# EAGLE design cubetto_1 (EAGLE 8.6.3)
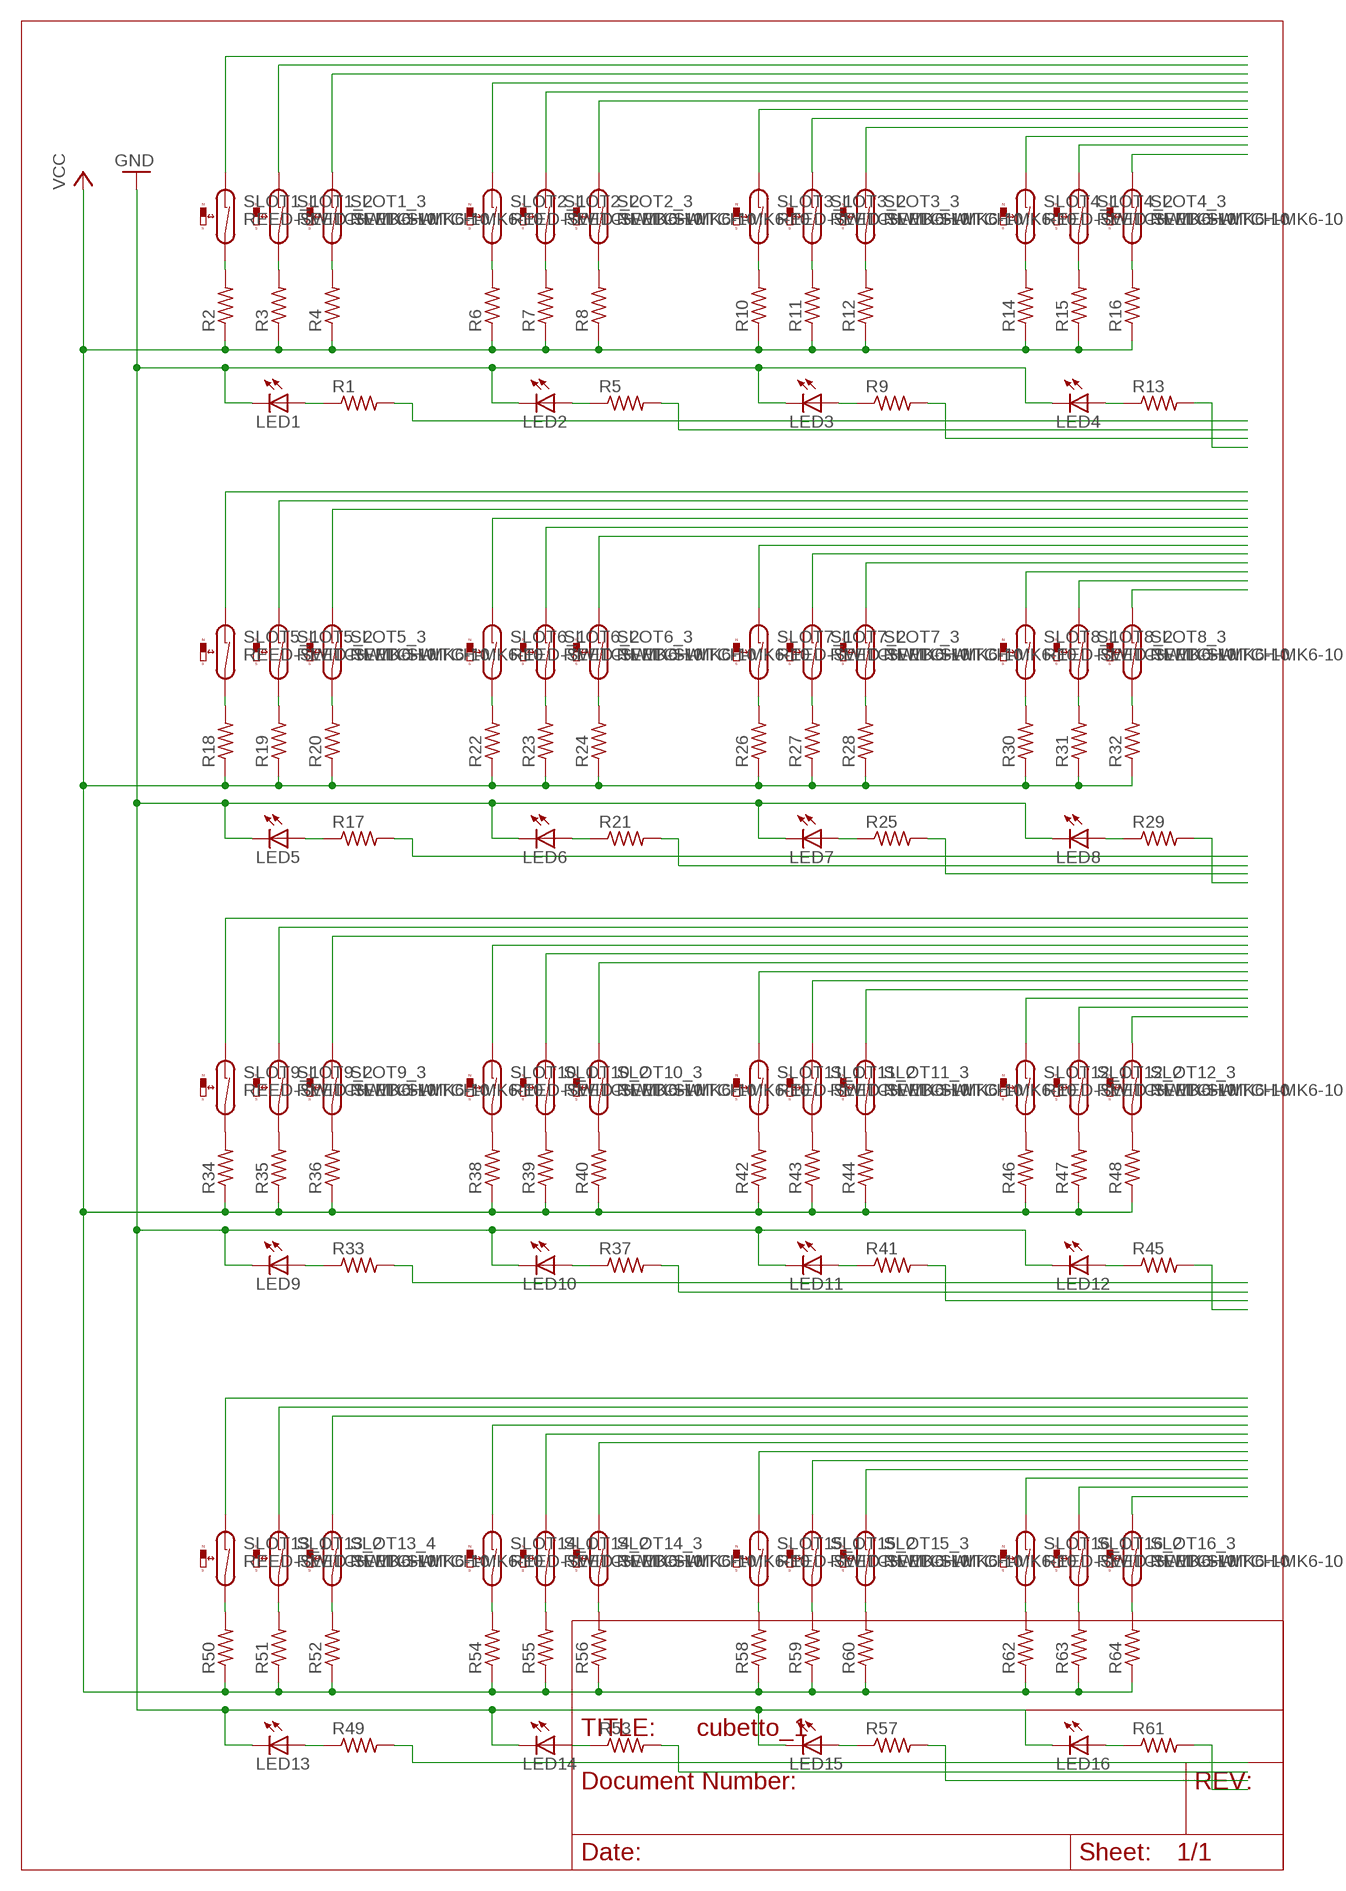
[diagram p0: schematic, sheet 1]

## Parts
LED1  LED3MM  [LED3MM]
LED2  LED3MM  [LED3MM]
LED3  LED3MM  [LED3MM]
LED4  LED3MM  [LED3MM]
LED5  LED3MM  [LED3MM]
LED6  LED3MM  [LED3MM]
LED7  LED3MM  [LED3MM]
LED8  LED3MM  [LED3MM]
LED9  LED3MM  [LED3MM]
LED10  LED3MM  [LED3MM]
LED11  LED3MM  [LED3MM]
LED12  LED3MM  [LED3MM]
LED13  LED3MM  [LED3MM]
LED14  LED3MM  [LED3MM]
LED15  LED3MM  [LED3MM]
LED16  LED3MM  [LED3MM]
R1  R-US_0207/10  [0207/10]
R2  R-US_0207/10  [0207/10]
R3  R-US_0207/10  [0207/10]
R4  R-US_0207/10  [0207/10]
R5  R-US_0207/10  [0207/10]
R6  R-US_0207/10  [0207/10]
R7  R-US_0207/10  [0207/10]
R8  R-US_0207/10  [0207/10]
R9  R-US_0207/10  [0207/10]
R10  R-US_0207/10  [0207/10]
R11  R-US_0207/10  [0207/10]
R12  R-US_0207/10  [0207/10]
R13  R-US_0207/10  [0207/10]
R14  R-US_0207/10  [0207/10]
R15  R-US_0207/10  [0207/10]
R16  R-US_0207/10  [0207/10]
R17  R-US_0207/10  [0207/10]
R18  R-US_0207/10  [0207/10]
R19  R-US_0207/10  [0207/10]
R20  R-US_0207/10  [0207/10]
R21  R-US_0207/10  [0207/10]
R22  R-US_0207/10  [0207/10]
R23  R-US_0207/10  [0207/10]
R24  R-US_0207/10  [0207/10]
R25  R-US_0207/10  [0207/10]
R26  R-US_0207/10  [0207/10]
R27  R-US_0207/10  [0207/10]
R28  R-US_0207/10  [0207/10]
R29  R-US_0207/10  [0207/10]
R30  R-US_0207/10  [0207/10]
R31  R-US_0207/10  [0207/10]
R32  R-US_0207/10  [0207/10]
R33  R-US_0207/10  [0207/10]
R34  R-US_0207/10  [0207/10]
R35  R-US_0207/10  [0207/10]
R36  R-US_0207/10  [0207/10]
R37  R-US_0207/10  [0207/10]
R38  R-US_0207/10  [0207/10]
R39  R-US_0207/10  [0207/10]
R40  R-US_0207/10  [0207/10]
R41  R-US_0207/10  [0207/10]
R42  R-US_0207/10  [0207/10]
R43  R-US_0207/10  [0207/10]
R44  R-US_0207/10  [0207/10]
R45  R-US_0207/10  [0207/10]
R46  R-US_0207/10  [0207/10]
R47  R-US_0207/10  [0207/10]
R48  R-US_0207/10  [0207/10]
R49  R-US_0207/10  [0207/10]
R50  R-US_0207/10  [0207/10]
R51  R-US_0207/10  [0207/10]
R52  R-US_0207/10  [0207/10]
R53  R-US_0207/10  [0207/10]
R54  R-US_0207/10  [0207/10]
R55  R-US_0207/10  [0207/10]
R56  R-US_0207/10  [0207/10]
R57  R-US_0207/10  [0207/10]
R58  R-US_0207/10  [0207/10]
R59  R-US_0207/10  [0207/10]
R60  R-US_0207/10  [0207/10]
R61  R-US_0207/10  [0207/10]
R62  R-US_0207/10  [0207/10]
R63  R-US_0207/10  [0207/10]
R64  R-US_0207/10  [0207/10]
SLOT1_1  REED-SWITCH-MK6-10  [MK6-10]
SLOT1_2  REED-SWITCH-MK6-10  [MK6-10]
SLOT1_3  REED-SWITCH-MK6-10  [MK6-10]
SLOT2_1  REED-SWITCH-MK6-10  [MK6-10]
SLOT2_2  REED-SWITCH-MK6-10  [MK6-10]
SLOT2_3  REED-SWITCH-MK6-10  [MK6-10]
SLOT3_1  REED-SWITCH-MK6-10  [MK6-10]
SLOT3_2  REED-SWITCH-MK6-10  [MK6-10]
SLOT3_3  REED-SWITCH-MK6-10  [MK6-10]
SLOT4_1  REED-SWITCH-MK6-10  [MK6-10]
SLOT4_2  REED-SWITCH-MK6-10  [MK6-10]
SLOT4_3  REED-SWITCH-MK6-10  [MK6-10]
SLOT5_1  REED-SWITCH-MK6-10  [MK6-10]
SLOT5_2  REED-SWITCH-MK6-10  [MK6-10]
SLOT5_3  REED-SWITCH-MK6-10  [MK6-10]
SLOT6_1  REED-SWITCH-MK6-10  [MK6-10]
SLOT6_2  REED-SWITCH-MK6-10  [MK6-10]
SLOT6_3  REED-SWITCH-MK6-10  [MK6-10]
SLOT7_1  REED-SWITCH-MK6-10  [MK6-10]
SLOT7_2  REED-SWITCH-MK6-10  [MK6-10]
SLOT7_3  REED-SWITCH-MK6-10  [MK6-10]
SLOT8_1  REED-SWITCH-MK6-10  [MK6-10]
SLOT8_2  REED-SWITCH-MK6-10  [MK6-10]
SLOT8_3  REED-SWITCH-MK6-10  [MK6-10]
SLOT9_1  REED-SWITCH-MK6-10  [MK6-10]
SLOT9_2  REED-SWITCH-MK6-10  [MK6-10]
SLOT9_3  REED-SWITCH-MK6-10  [MK6-10]
SLOT10_1  REED-SWITCH-MK6-10  [MK6-10]
SLOT10_2  REED-SWITCH-MK6-10  [MK6-10]
SLOT10_3  REED-SWITCH-MK6-10  [MK6-10]
SLOT11_1  REED-SWITCH-MK6-10  [MK6-10]
SLOT11_2  REED-SWITCH-MK6-10  [MK6-10]
SLOT11_3  REED-SWITCH-MK6-10  [MK6-10]
SLOT12_1  REED-SWITCH-MK6-10  [MK6-10]
SLOT12_2  REED-SWITCH-MK6-10  [MK6-10]
SLOT12_3  REED-SWITCH-MK6-10  [MK6-10]
SLOT13_1  REED-SWITCH-MK6-10  [MK6-10]
SLOT13_2  REED-SWITCH-MK6-10  [MK6-10]
SLOT13_4  REED-SWITCH-MK6-10  [MK6-10]
SLOT14_1  REED-SWITCH-MK6-10  [MK6-10]
SLOT14_2  REED-SWITCH-MK6-10  [MK6-10]
SLOT14_3  REED-SWITCH-MK6-10  [MK6-10]
SLOT15_1  REED-SWITCH-MK6-10  [MK6-10]
SLOT15_2  REED-SWITCH-MK6-10  [MK6-10]
SLOT15_3  REED-SWITCH-MK6-10  [MK6-10]
SLOT16_1  REED-SWITCH-MK6-10  [MK6-10]
SLOT16_2  REED-SWITCH-MK6-10  [MK6-10]
SLOT16_3  REED-SWITCH-MK6-10  [MK6-10]

## Nets
GND: LED1.K(C) LED2.K(C) LED3.K(C) LED4.K(C) LED5.K(C) LED6.K(C) LED7.K(C) LED8.K(C) LED9.K(C) LED10.K(C) LED11.K(C) LED12.K(C) LED13.K(C) LED14.K(C) LED15.K(C) LED16.K(C)
N$1: LED1.A R1.1
N$2: R2.2 SLOT1_1.2
N$3: R3.2 SLOT1_2.2
N$4: R4.2 SLOT1_3.2
N$5: LED2.A R5.1
N$6: R6.2 SLOT2_1.2
N$7: R7.2 SLOT2_2.2
N$8: R8.2 SLOT2_3.2
N$9: LED3.A R9.1
N$10: R10.2 SLOT3_1.2
N$11: R11.2 SLOT3_2.2
N$12: R12.2 SLOT3_3.2
N$13: LED4.A R13.1
N$14: R14.2 SLOT4_1.2
N$15: R15.2 SLOT4_2.2
N$16: R16.2 SLOT4_3.2
N$17: SLOT4_3.1
N$18: SLOT4_2.1
N$19: SLOT4_1.1
N$20: SLOT3_3.1
N$22: SLOT3_1.1
N$23: SLOT2_3.1
N$24: SLOT2_2.1
N$25: SLOT2_1.1
N$26: SLOT1_3.1
N$27: SLOT1_2.1
N$28: SLOT1_1.1
N$29: R1.2
N$30: R5.2
N$31: R9.2
N$32: R13.2
N$33: LED5.A R17.1
N$34: R18.2 SLOT5_1.2
N$35: R19.2 SLOT5_2.2
N$36: R20.2 SLOT5_3.2
N$37: LED6.A R21.1
N$38: R22.2 SLOT6_1.2
N$39: R23.2 SLOT6_2.2
N$40: R24.2 SLOT6_3.2
N$41: LED7.A R25.1
N$42: R26.2 SLOT7_1.2
N$43: R27.2 SLOT7_2.2
N$44: R28.2 SLOT7_3.2
N$45: LED8.A R29.1
N$46: R30.2 SLOT8_1.2
N$47: R31.2 SLOT8_2.2
N$48: R32.2 SLOT8_3.2
N$49: SLOT8_3.1
N$50: SLOT8_2.1
N$51: SLOT8_1.1
N$52: SLOT7_3.1
N$53: SLOT7_2.1
N$54: SLOT7_1.1
N$55: SLOT6_3.1
N$56: SLOT6_2.1
N$57: SLOT6_1.1
N$58: SLOT5_3.1
N$59: SLOT5_2.1
N$60: SLOT5_1.1
N$61: R17.2
N$62: R21.2
N$63: R25.2
N$64: R29.2
N$65: LED9.A R33.1
N$66: R34.2 SLOT9_1.2
N$67: R35.2 SLOT9_2.2
N$68: R36.2 SLOT9_3.2
N$69: LED10.A R37.1
N$70: R38.2 SLOT10_1.2
N$71: R39.2 SLOT10_2.2
N$72: R40.2 SLOT10_3.2
N$73: LED11.A R41.1
N$74: R42.2 SLOT11_1.2
N$75: R43.2 SLOT11_2.2
N$76: R44.2 SLOT11_3.2
N$77: LED12.A R45.1
N$78: R46.2 SLOT12_1.2
N$79: R47.2 SLOT12_2.2
N$80: R48.2 SLOT12_3.2
N$81: SLOT12_3.1
N$82: SLOT12_2.1
N$83: SLOT12_1.1
N$84: SLOT11_3.1
N$85: SLOT11_2.1
N$86: SLOT11_1.1
N$87: SLOT10_3.1
N$88: SLOT10_2.1
N$89: SLOT10_1.1
N$90: SLOT9_3.1
N$91: SLOT9_2.1
N$92: SLOT9_1.1
N$93: R33.2
N$94: R37.2
N$95: R41.2
N$96: R45.2
N$97: LED13.A R49.1
N$98: R50.2 SLOT13_1.2
N$99: R51.2 SLOT13_2.2
N$100: R52.2 SLOT13_4.2
N$101: LED14.A R53.1
N$102: R54.2 SLOT14_1.2
N$103: R55.2 SLOT14_2.2
N$104: R56.2 SLOT14_3.2
N$105: LED15.A R57.1
N$106: R58.2 SLOT15_1.2
N$107: R59.2 SLOT15_2.2
N$108: R60.2 SLOT15_3.2
N$109: LED16.A R61.1
N$110: R62.2 SLOT16_1.2
N$111: R63.2 SLOT16_2.2
N$112: R64.2 SLOT16_3.2
N$113: SLOT16_3.1
N$114: SLOT16_2.1
N$115: SLOT16_1.1
N$116: SLOT15_3.1
N$117: SLOT15_2.1
N$118: SLOT15_1.1
N$119: SLOT14_3.1
N$120: SLOT14_2.1
N$121: SLOT14_1.1
N$122: SLOT13_4.1
N$123: SLOT13_2.1
N$124: SLOT13_1.1
N$125: R49.2
N$126: R53.2
N$127: R57.2
N$128: R61.2
N$129: SLOT3_2.1
VCC: R2.1 R3.1 R4.1 R6.1 R7.1 R8.1 R10.1 R11.1 R12.1 R14.1 R15.1 R16.1 R18.1 R19.1 R20.1 R22.1 R23.1 R24.1 R26.1 R27.1 R28.1 R30.1 R31.1 R32.1 R34.1 R35.1 R36.1 R38.1 R39.1 R40.1 R42.1 R43.1 R44.1 R46.1 R47.1 R48.1 R50.1 R51.1 R52.1 R54.1 R55.1 R56.1 R58.1 R59.1 R60.1 R62.1 R63.1 R64.1

## Library data of the parts
LED1-LED16 = led:LED: LED OSRAM: - CHIPLED LG R971, LG N971, LY N971, LG Q971, LY Q971, LO R971, LY R971 LH N974, LH R974 LS Q976, LO Q976, LY Q976 LO Q996 - Hyper CHIPLED LW Q18S LB Q993, LB Q99A, LB R99A - SideLED LS A670, LO A670, LY A670, LG A670, LP A670 LB A673, LV A673, LT A673, LW A673 LH A674 LY A675 LS A676, LA A676, LO A676, LY A676, LW A676 LS A679, LY A679, LG A679 - Hyper Micro SIDELED® LS Y876, LA Y876, LO Y876, LY Y876 LT Y87S - SmartLED LW L88C, LW L88S LB L89C, LB L89S, LG L890 LS L89K, LO L89K, LY L89K LS L896, LA L896, LO L896, LY L896 - TOPLED LS T670, LO T670, LY T670, LG T670, LP T670 LSG T670, LSP T670, LSY T670, LOP T670, LYG T670 LG T671, LOG T671, LSG T671 LB T673, LV T673, LT T673, LW T673 LH T674 LS T676, LA T676, LO T676, LY T676, LB T676, LH T676, LSB T676, LW T676 LB T67C, LV T67C, LT T67C, LS T67K, LO T67K, LY T67K, LW E67C LS E67B, LA E67B, LO E67B, LY E67B, LB E67C, LV E67C, LT E67C LW T67C LS T679, LY T679, LG T679 LS T770, LO T770, LY T770, LG T770, LP T770 LB T773, LV T773, LT T773, LW T773 LH T774 LS E675, LA E675, LY E675, LS T675 LS T776, LA T776, LO T776, LY T776, LB T776 LHGB T686 LT T68C, LB T68C - Hyper Mini TOPLED® LB M676 - Mini TOPLED Santana® LG M470 LS M47K, LO M47K, LY M47K Source: http://www.osram.convergy.de LUXEON: - LUMILED® LXK2-PW12-R00, LXK2-PW12-S00, LXK2-PW14-U00, LXK2-PW14-V00 LXK2-PM12-R00, LXK2-PM12-S00, LXK2-PM14-U00 LXK2-PE12-Q00, LXK2-PE12-R00, LXK2-PE12-S00, LXK2-PE14-T00, LXK2-PE14-U00 LXK2-PB12-K00, LXK2-PB12-L00, LXK2-PB12-M00, LXK2-PB14-N00, LXK2-PB14-P00, LXK2-PB14-Q00 LXK2-PR12-L00, LXK2-PR12-M00, LXK2-PR14-Q00, LXK2-PR14-R00 LXK2-PD12-Q00, LXK2-PD12-R00, LXK2-PD12-S00 LXK2-PH12-R00, LXK2-PH12-S00 LXK2-PL12-P00, LXK2-PL12-Q00, LXK2-PL12-R00 Source: www.luxeon.com KINGBRIGHT: KA-3528ASYC Source: www.kingbright.com
R1-R64 = rcl:R-US_: RESISTOR, American symbol; SPICEPREFIX: R
SLOT1_1-SLOT1_3 SLOT2_1-SLOT2_3 SLOT3_1-SLOT3_3 SLOT4_1-SLOT4_3 SLOT5_1-SLOT5_3 SLOT6_1-SLOT6_3 SLOT7_1-SLOT7_3 SLOT8_1-SLOT8_3 SLOT9_1-SLOT9_3 SLOT10_1-SLOT10_3 SLOT11_1-SLOT11_3 SLOT12_1-SLOT12_3 SLOT13_1 SLOT13_2 SLOT13_4 SLOT14_1-SLOT14_3 SLOT15_1-SLOT15_3 SLOT16_1-SLOT16_3 = switch-reed:REED-SWITCH-: Reed Sensor; OC_FARNELL: unknown

## Board
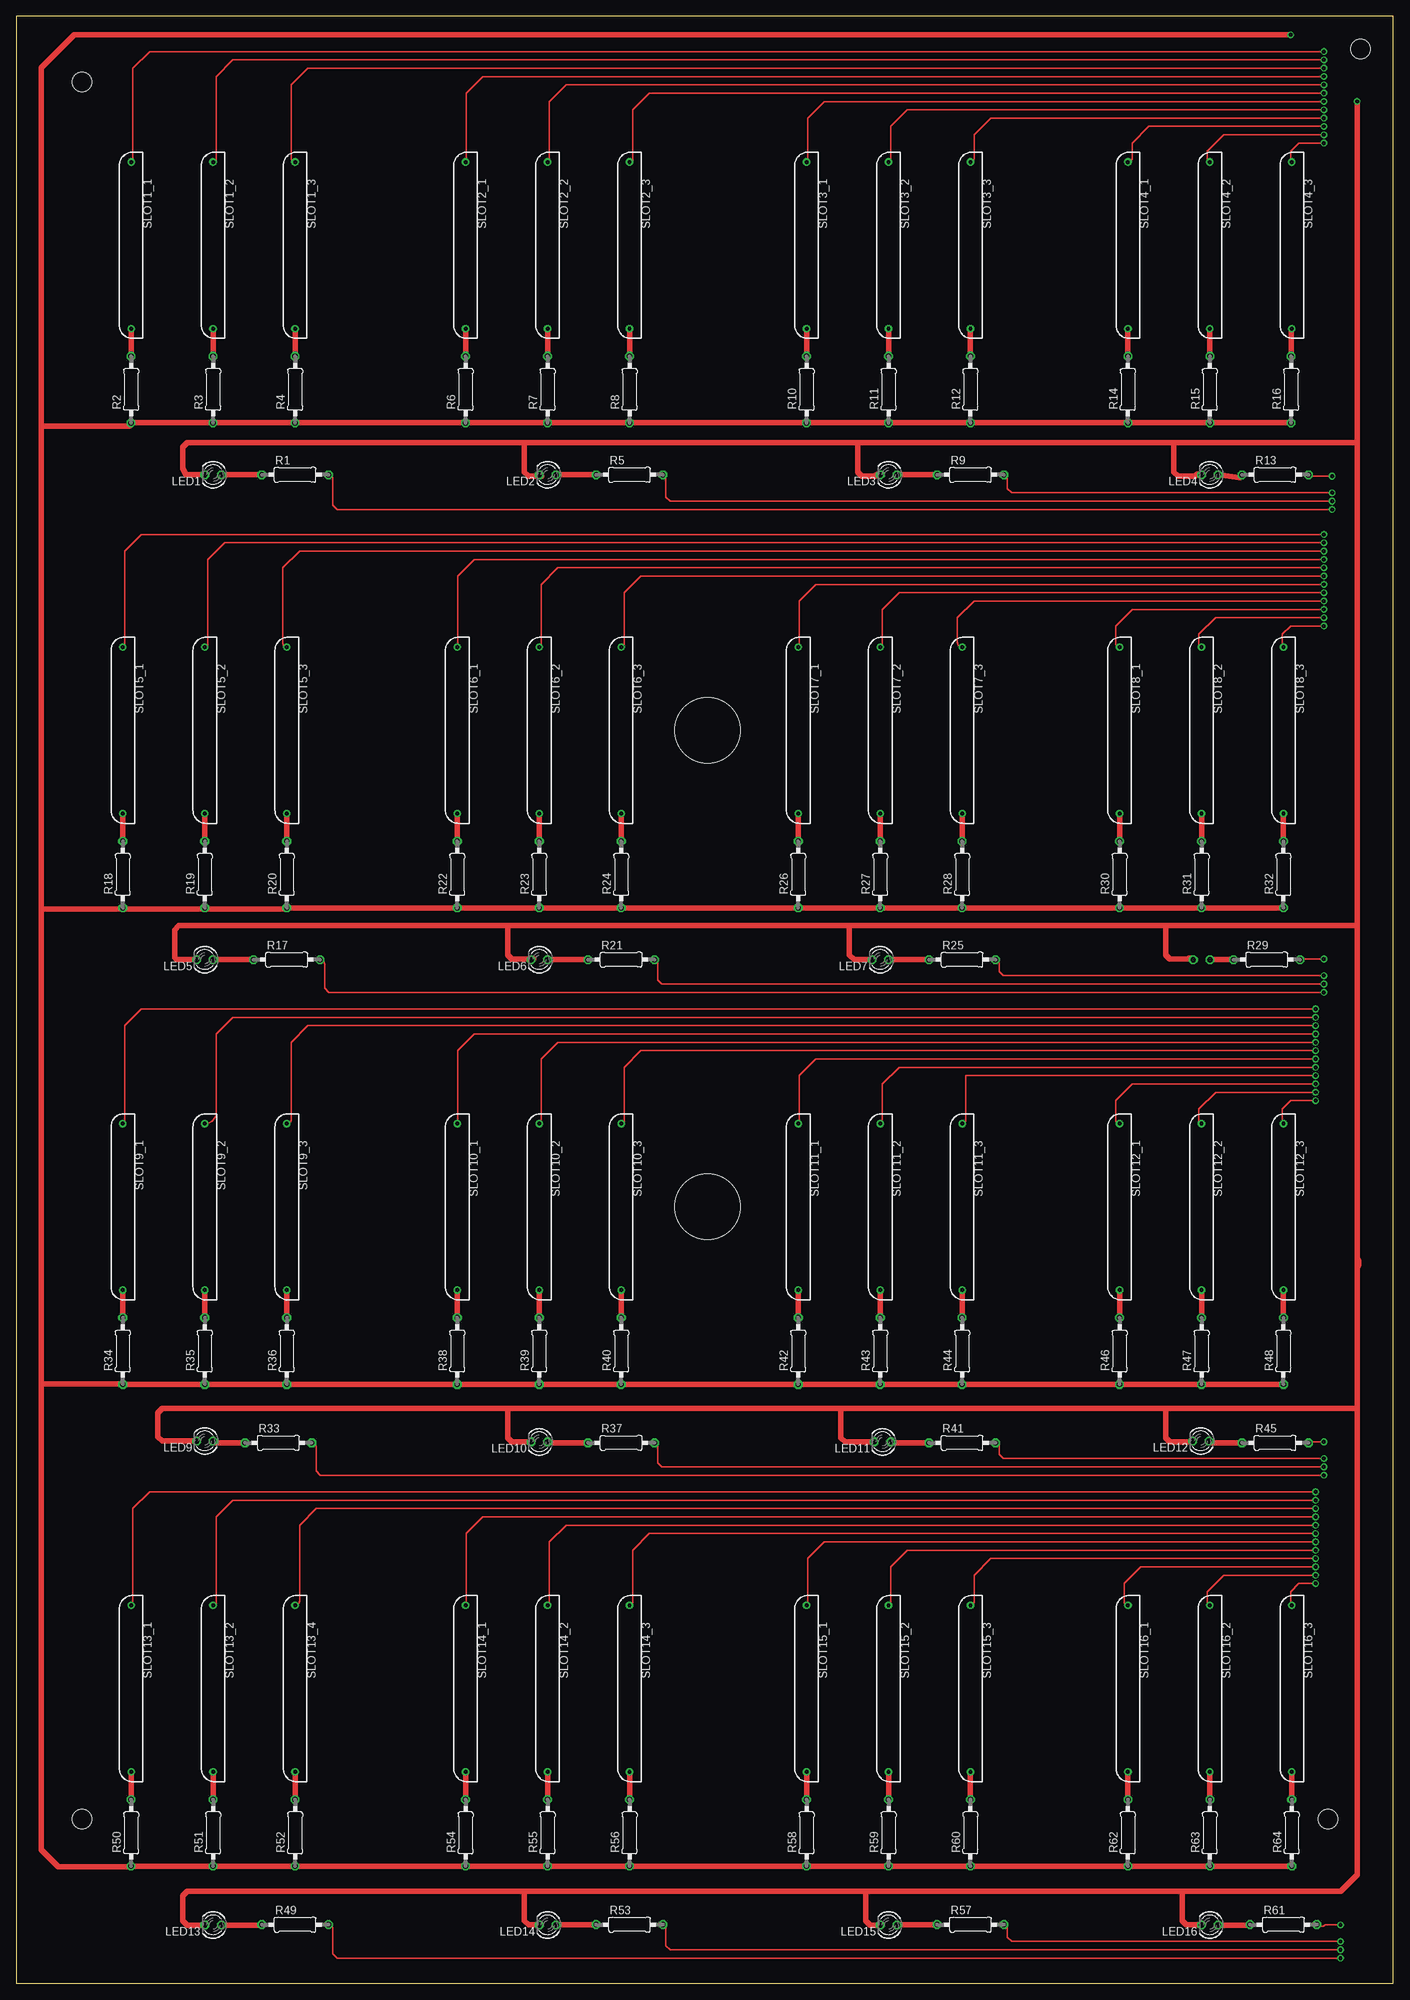
[diagram p1: board, top side]
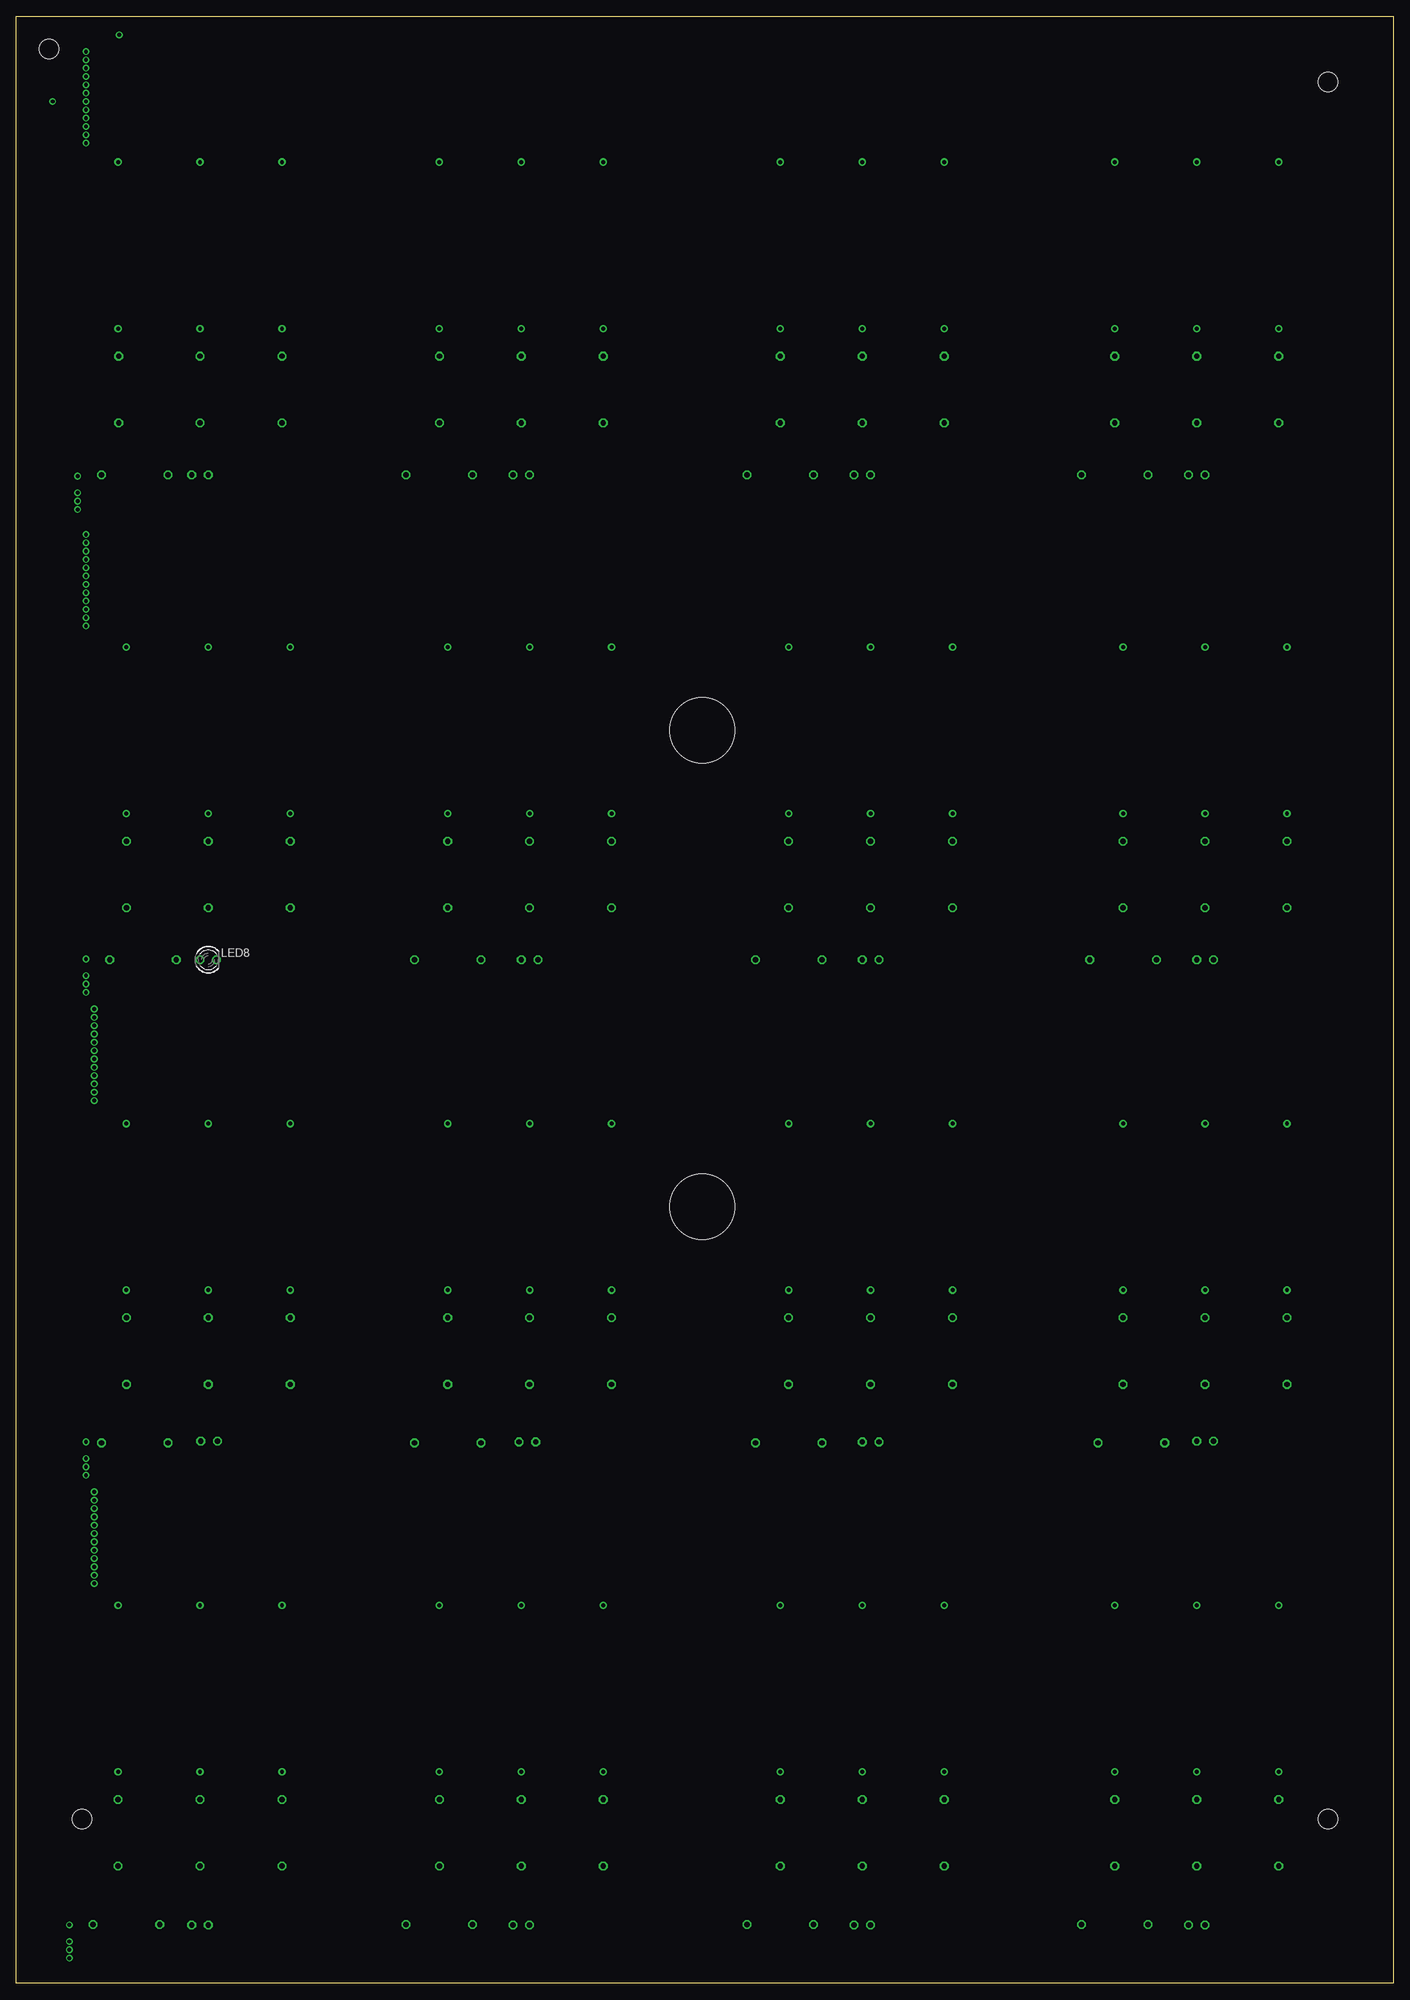
[diagram p2: board, bottom side, seen from below]

Size 210 x 300 mm. Coordinates in mm from the lower left corner, seen from the top.
Outline: 0,0 210,0 210,300 0,300 0,0
Copper layers (1*16): Top 0.035mm / dielectric 1.5mm / Bottom 0.035mm
Design rules "default *": minimum track width 10mil, minimum drill 0.35mm, track to track 10mil, track to pad 10mil, pad to pad 10mil, via to via 10mil, smd to smd 10mil, copper to edge 40mil, drill to drill 8mil, minimum pad ring 10mil, minimum via ring 8mil, stop-mask expansion 4mil, vias tented up to drill 0mil, thermal gap 10mil
Holes 3 mm at 10,25 200,25 205,295 10,290
Holes 10 mm at 105.41,118.41 105.41,191.11

### Footprints (pad centres in the part's own frame; a part is rotated, then mirrored left to right if it is on the bottom)
LED3MM = drill 0.813 octagon: A -1.27,0; K 1.27,0
0207/10 = drill 0.813 octagon: 1 -5.08,0; 2 5.08,0
MK6-10 = drill 0.6 pad 1.016: 1 -12.7,0; 2 12.7,0

### Placement (x,y rotation side)
LED1  30,230.08 180 top
LED2  81,230.08 180 top
LED3  133,230.08 180 top
LED4  182,230.08 180 top
LED5  28.73,156.11 180 top
LED6  79.73,156.11 180 top
LED7  131.73,156.11 180 top
LED8  180.73,156.11 0 bottom
LED9  28.73,82.69 180 top
LED10  79.73,82.55 180 top
LED11  132.08,82.55 180 top
LED12  180.62,82.69 180 top
LED13  30,8.86 180 top
LED14  81,8.86 180 top
LED15  133,8.86 180 top
LED16  182,8.86 180 top
R1  42.5,230.08 0 top
R2  17.5,243.08 90 top
R3  30,243.08 90 top
R4  42.5,243.08 90 top
R5  93.5,230.08 0 top
R6  68.5,243.08 90 top
R7  81,243.08 90 top
R8  93.5,243.08 90 top
R9  145.5,230.08 0 top
R10  120.5,243.08 90 top
R11  133,243.08 90 top
R12  145.5,243.08 90 top
R13  191.96,230.08 0 top
R14  169.5,243.08 90 top
R15  182,243.08 90 top
R16  194.4,243.08 90 top
R17  41.23,156.11 0 top
R18  16.23,169.11 90 top
R19  28.73,169.11 90 top
R20  41.23,169.11 90 top
R21  92.23,156.11 0 top
R22  67.23,169.11 90 top
R23  79.73,169.11 90 top
R24  92.23,169.11 90 top
R25  144.23,156.11 0 top
R26  119.23,169.11 90 top
R27  131.73,169.11 90 top
R28  144.23,169.11 90 top
R29  190.69,156.11 0 top
R30  168.23,169.11 90 top
R31  180.73,169.11 90 top
R32  193.23,169.11 90 top
R33  39.96,82.41 0 top
R34  16.23,96.41 90 top
R35  28.73,96.41 90 top
R36  41.23,96.41 90 top
R37  92.23,82.41 0 top
R38  67.23,96.41 90 top
R39  79.73,96.41 90 top
R40  92.23,96.41 90 top
R41  144.23,82.41 0 top
R42  119.23,96.41 90 top
R43  131.73,96.41 90 top
R44  144.23,96.41 90 top
R45  191.96,82.41 0 top
R46  168.23,96.41 90 top
R47  180.73,96.41 90 top
R48  193.23,96.41 90 top
R49  42.5,8.92 0 top
R50  17.5,22.92 90 top
R51  30,22.92 90 top
R52  42.5,22.92 90 top
R53  93.5,8.92 0 top
R54  68.5,22.92 90 top
R55  81,22.92 90 top
R56  93.5,22.92 90 top
R57  145.5,8.92 0 top
R58  120.5,22.92 90 top
R59  133,22.92 90 top
R60  145.5,22.92 90 top
R61  193.23,8.92 0 top
R62  169.5,22.92 90 top
R63  182,22.92 90 top
R64  194.5,22.92 90 top
SLOT1_1  17.5,265.08 270 top
SLOT1_2  30,265.08 270 top
SLOT1_3  42.5,265.08 270 top
SLOT2_1  68.5,265.08 270 top
SLOT2_2  81,265.08 270 top
SLOT2_3  93.5,265.08 270 top
SLOT3_1  120.5,265.08 270 top
SLOT3_2  133,265.08 270 top
SLOT3_3  145.5,265.08 270 top
SLOT4_1  169.5,265.08 270 top
SLOT4_2  182,265.08 270 top
SLOT4_3  194.5,265.08 270 top
SLOT5_1  16.23,191.11 270 top
SLOT5_2  28.73,191.11 270 top
SLOT5_3  41.23,191.11 270 top
SLOT6_1  67.23,191.11 270 top
SLOT6_2  79.73,191.11 270 top
SLOT6_3  92.23,191.11 270 top
SLOT7_1  119.23,191.11 270 top
SLOT7_2  131.73,191.11 270 top
SLOT7_3  144.23,191.11 270 top
SLOT8_1  168.23,191.11 270 top
SLOT8_2  180.73,191.11 270 top
SLOT8_3  193.23,191.11 270 top
SLOT9_1  16.23,118.41 270 top
SLOT9_2  28.73,118.41 270 top
SLOT9_3  41.23,118.41 270 top
SLOT10_1  67.23,118.41 270 top
SLOT10_2  79.73,118.41 270 top
SLOT10_3  92.23,118.41 270 top
SLOT11_1  119.23,118.41 270 top
SLOT11_2  131.73,118.41 270 top
SLOT11_3  144.23,118.41 270 top
SLOT12_1  168.23,118.41 270 top
SLOT12_2  180.73,118.41 270 top
SLOT12_3  193.23,118.41 270 top
SLOT13_1  17.5,44.92 270 top
SLOT13_2  30,44.92 270 top
SLOT13_4  42.5,44.92 270 top
SLOT14_1  68.5,44.92 270 top
SLOT14_2  81,44.92 270 top
SLOT14_3  93.5,44.92 270 top
SLOT15_1  120.5,44.92 270 top
SLOT15_2  133,44.92 270 top
SLOT15_3  145.5,44.92 270 top
SLOT16_1  169.5,44.92 270 top
SLOT16_2  182,44.92 270 top
SLOT16_3  194.5,44.92 270 top

### Tracks (layer width: path | path; a pad name or v marks a point on that pad's centre or on a via)
GND  (via drill 0.6)
  Top 0.813: 77.47,234.95 26.04,234.95 25.4,234.31 25.4,231.11 25.82,230.08 LED1.K | 77.47,234.95 128.27,234.95 | 128.27,234.95 176.53,234.95 | LED2.K arc90 80.08,229.87 78.11,229.87 77.47,230.5 77.47,234.95 | LED3.K arc90 130.95,229.87 128.91,229.87 128.27,230.5 128.27,234.95 | LED4.K arc90 179.74,229.87 177.16,229.87 176.53,230.5 176.53,234.95 | LED13.K 26.04,8.86 25.4,9.49 25.4,13.34 26.04,13.97 77.47,13.97 | 177.8,13.97 201.93,13.97 204.47,16.51 204.47,87.63 | 177.8,13.97 129.54,13.97 | 129.54,13.97 77.47,13.97 | 204.47,110.49 204.47,161.29 | 204.47,161.29 204.47,234.95 | 204.47,234.95 v204.47,287.02 | 74.93,161.29 24.77,161.29 24.13,160.66 24.13,156.47 24.37,156.11 LED5.K | 74.93,161.29 127,161.29 | 127,161.29 175.26,161.29 | LED6.K arc-90 78.92,156.21 75.56,156.21 74.93,156.84 74.93,161.29 | 127,161.29 127,156.84 127.73,156.11 LED7.K | LED8.K arc90 178.58,156.21 175.9,156.21 175.26,156.84 175.26,161.29 | 204.47,110.49 arc-90 204.47,109.22 | LED9.K 22.23,82.69 21.59,83.33 21.59,87 22.23,87.63 74.93,87.63 | 175.26,87.63 125.73,87.63 | 125.73,87.63 74.93,87.63 | 74.93,87.63 74.93,83.19 75.56,82.55 LED10.K | LED11.K 126.36,82.55 125.73,83.19 125.73,87.63 | LED12.K arc-90 179.21,82.55 175.9,82.55 175.26,83.19 175.26,87.63 | 204.47,109.22 204.47,110.49 | 176.53,234.95 204.47,234.95 | 175.26,161.29 204.47,161.29 | 204.47,87.63 204.47,109.22 | 175.26,87.63 204.47,87.63 | LED16.K 180.7,8.89 178.44,8.89 177.8,9.53 177.8,13.97 | LED15.K 130.18,8.86 129.54,9.49 129.54,13.97 | LED14.K 79.7,8.89 78.11,8.89 77.47,9.53 77.47,13.97
N$1
  Top 0.813: R1.1 LED1.A
N$2
  Top 0.813: R2.2 SLOT1_1.2
N$3
  Top 0.813: R3.2 SLOT1_2.2
N$4
  Top 0.813: R4.2 SLOT1_3.2
N$5
  Top 0.813: R5.1 LED2.A
N$6
  Top 0.813: R6.2 SLOT2_1.2
N$7
  Top 0.813: R7.2 SLOT2_2.2
N$8
  Top 0.813: R8.2 SLOT2_3.2
N$9
  Top 0.813: R9.1 LED3.A 134.12,230.08
N$10
  Top 0.813: R10.2 SLOT3_1.2
N$11
  Top 0.813: R11.2 SLOT3_2.2
N$12
  Top 0.813: R12.2 SLOT3_3.2
N$13
  Top 0.813: R13.1 arc-90 186.46,229.66 LED4.A
N$14
  Top 0.813: R14.2 SLOT4_1.2
N$15
  Top 0.813: R15.2 SLOT4_2.2
N$16
  Top 0.813: R16.2 194.4,252.28 SLOT4_3.2
N$17  (via drill 0.6)
  Top 0.254: SLOT4_3.1 194.31,277.97 194.31,279.4 195.58,280.67 v199.39,280.67
N$18  (via drill 0.6)
  Top 0.254: SLOT4_2.1 arc-90 181.61,278.17 181.61,279.4 184.15,281.94 v199.39,281.94
N$19  (via drill 0.6)
  Top 0.254: SLOT4_1.1 arc90 170.18,278.46 170.18,280.67 172.72,283.21 v199.39,283.21
N$20  (via drill 0.6)
  Top 0.254: SLOT3_3.1 arc90 146.05,278.33 146.05,281.94 148.59,284.48 v199.39,284.48
N$22  (via drill 0.6)
  Top 0.254: SLOT3_1.1 arc90 120.65,277.93 120.65,284.48 123.19,287.02 v199.39,287.02
N$23  (via drill 0.6)
  Top 0.254: SLOT2_3.1 arc90 93.98,278.26 93.98,285.75 96.52,288.29 v199.39,288.29
N$24  (via drill 0.6)
  Top 0.254: SLOT2_2.1 arc90 81.28,278.06 81.28,287.02 83.82,289.56 v199.39,289.56
N$25  (via drill 0.6)
  Top 0.254: SLOT2_1.1 arc90 68.58,277.86 68.58,288.29 71.12,290.83 v199.39,290.83
N$26  (via drill 0.6)
  Top 0.254: SLOT1_3.1 arc-90 41.91,278.37 41.91,289.56 44.45,292.1 v199.39,292.1
N$27  (via drill 0.6)
  Top 0.254: SLOT1_2.1 arc90 30.48,278.26 30.48,290.83 33.02,293.37 v199.39,293.37
N$28  (via drill 0.6)
  Top 0.254: SLOT1_1.1 arc90 17.78,278.06 17.78,292.1 20.32,294.64 v199.39,294.64
N$29  (via drill 0.6)
  Top 0.254: R1.2 arc-90 48.26,229.4 48.26,225.43 48.9,224.79 v200.66,224.79
N$30  (via drill 0.6)
  Top 0.254: R5.2 arc-90 99.06,229.6 99.06,226.69 99.69,226.06 v200.66,226.06
N$31  (via drill 0.6)
  Top 0.254: R9.2 arc-90 151.13,229.53 151.13,227.97 151.76,227.33 v200.66,227.33
N$32  (via drill 0.6)
  Top 0.254: 197.25,229.87 v200.66,229.87
  Top 0.813: R13.2 197.25,229.87
N$33
  Top 0.813: LED5.A R17.1
N$34
  Top 0.813: SLOT5_1.2 R18.2
N$35
  Top 0.813: SLOT5_2.2 R19.2
N$36
  Top 0.813: R20.2 SLOT5_3.2
N$37
  Top 0.813: LED6.A R21.1
N$38
  Top 0.813: R22.2 SLOT6_1.2
N$39
  Top 0.813: R23.2 SLOT6_2.2
N$40
  Top 0.813: R24.2 SLOT6_3.2
N$41
  Top 0.813: LED7.A R25.1
N$42
  Top 0.813: R26.2 SLOT7_1.2
N$43
  Top 0.813: R27.2 SLOT7_2.2
N$44
  Top 0.813: R28.2 SLOT7_3.2
N$45
  Top 0.813: LED8.A R29.1
N$46
  Top 0.813: R30.2 SLOT8_1.2
N$47
  Top 0.813: R31.2 SLOT8_2.2
N$48
  Top 0.813: R32.2 SLOT8_3.2
N$49  (via drill 0.6)
  Top 0.254: SLOT8_3.1 arc-90 193.04,204 193.04,205.74 194.31,207.01 v199.39,207.01
N$50  (via drill 0.6)
  Top 0.254: SLOT8_2.1 arc-90 180.34,204.2 180.34,205.74 182.88,208.28 v199.39,208.28
N$51  (via drill 0.6)
  Top 0.254: SLOT8_1.1 arc-90 167.64,204.4 167.64,207.01 170.18,209.55 v199.39,209.55
N$52  (via drill 0.6)
  Top 0.254: SLOT7_3.1 arc-90 143.51,204.53 143.51,208.28 146.05,210.82 v199.39,210.82
N$53  (via drill 0.6)
  Top 0.254: SLOT7_2.1 arc90 132.08,204.16 132.08,209.55 134.62,212.09 v199.39,212.09
N$54  (via drill 0.6)
  Top 0.254: SLOT7_1.1 arc90 119.38,203.96 119.38,210.82 121.92,213.36 v199.39,213.36
N$55  (via drill 0.6)
  Top 0.254: SLOT6_3.1 arc90 92.71,204.29 92.71,212.09 95.25,214.63 v199.39,214.63
N$56  (via drill 0.6)
  Top 0.254: SLOT6_2.1 arc90 80.01,204.09 80.01,213.36 82.55,215.9 v199.39,215.9
N$57  (via drill 0.6)
  Top 0.254: SLOT6_1.1 arc90 67.31,203.89 67.31,214.63 69.85,217.17 v199.39,217.17
N$58  (via drill 0.6)
  Top 0.254: SLOT5_3.1 arc-90 40.64,204.4 40.64,215.9 43.18,218.44 v199.39,218.44
N$59  (via drill 0.6)
  Top 0.254: SLOT5_2.1 arc90 29.21,204.29 29.21,217.17 31.75,219.71 v199.39,219.71
N$60  (via drill 0.6)
  Top 0.254: SLOT5_1.1 arc90 16.51,204.09 16.51,218.44 19.05,220.98 v199.39,220.98
N$61  (via drill 0.6)
  Top 0.254: R17.2 arc-90 46.99,155.43 46.99,151.76 47.62,151.13 v199.39,151.13
N$62  (via drill 0.6)
  Top 0.254: R21.2 arc-90 97.79,155.63 97.79,153.03 98.42,152.4 v199.39,152.4
N$63  (via drill 0.6)
  Top 0.254: R25.2 arc-90 149.86,155.56 149.86,154.31 150.5,153.67 v199.39,153.67
N$64  (via drill 0.6)
  Top 0.254: R29.2 arc-90 195.87,156.21 v199.39,156.21
N$65
  Top 0.813: R33.1 29.84,82.41 LED9.A
N$66
  Top 0.813: R34.2 SLOT9_1.2
N$67
  Top 0.813: R35.2 SLOT9_2.2
N$68
  Top 0.813: R36.2 SLOT9_3.2
N$69
  Top 0.813: R37.1 82.04,82.41 LED10.A
N$70
  Top 0.813: R38.2 SLOT10_1.2
N$71
  Top 0.813: R39.2 SLOT10_2.2
N$72
  Top 0.813: R40.2 SLOT10_3.2
N$73
  Top 0.813: LED11.A 133.49,82.41 R41.1
N$74
  Top 0.813: R42.2 SLOT11_1.2
N$75
  Top 0.813: R43.2 SLOT11_2.2
N$76
  Top 0.813: R44.2 SLOT11_3.2
N$77
  Top 0.813: 182.17,82.41 LED12.A arc90 182.17,82.41 | 182.17,82.41 R45.1
N$78
  Top 0.813: R46.2 SLOT12_1.2
N$79
  Top 0.813: R47.2 SLOT12_2.2
N$80
  Top 0.813: R48.2 SLOT12_3.2
N$81  (via drill 0.6)
  Top 0.254: SLOT12_3.1 arc-90 193.04,131.3 193.04,133.35 194.31,134.62 v198.12,134.62
N$82  (via drill 0.6)
  Top 0.254: SLOT12_2.1 arc-90 180.34,131.5 180.34,133.35 182.88,135.89 v198.12,135.89
N$83  (via drill 0.6)
  Top 0.254: SLOT12_1.1 arc-90 167.64,131.7 167.64,134.62 170.18,137.16 v198.12,137.16
N$84  (via drill 0.6)
  Top 0.254: SLOT11_3.1 arc90 144.78,131.66 144.78,138.43 v198.12,138.43
N$85  (via drill 0.6)
  Top 0.254: SLOT11_2.1 arc90 132.08,131.46 132.08,137.16 134.62,139.7 v198.12,139.7
N$86  (via drill 0.6)
  Top 0.254: SLOT11_1.1 arc90 119.38,131.26 119.38,138.43 121.92,140.97 v198.12,140.97
N$87  (via drill 0.6)
  Top 0.254: SLOT10_3.1 arc90 92.71,131.59 92.71,139.7 95.25,142.24 v198.12,142.24
N$88  (via drill 0.6)
  Top 0.254: SLOT10_2.1 arc90 80.01,131.39 80.01,140.97 82.55,143.51 v198.12,143.51
N$89  (via drill 0.6)
  Top 0.254: SLOT10_1.1 arc90 67.31,131.19 67.31,142.24 69.85,144.78 v198.12,144.78
N$90  (via drill 0.6)
  Top 0.254: SLOT9_3.1 arc90 41.91,131.79 41.91,143.51 44.45,146.05 v198.12,146.05
N$91  (via drill 0.6)
  Top 0.254: SLOT9_2.1 arc90 30.48,132.86 30.48,144.78 33.02,147.32 v198.12,147.32
N$92  (via drill 0.6)
  Top 0.254: SLOT9_1.1 arc90 16.51,131.39 16.51,146.05 19.05,148.59 v198.12,148.59
N$93  (via drill 0.6)
  Top 0.254: R33.2 arc-90 45.72,81.73 45.72,78.11 46.35,77.47 v199.39,77.47
N$94  (via drill 0.6)
  Top 0.254: R37.2 arc-90 97.79,81.93 97.79,79.38 98.42,78.74 v199.39,78.74
N$95  (via drill 0.6)
  Top 0.254: R41.2 arc-90 149.86,81.86 149.86,80.64 150.5,80.01 v199.39,80.01
N$96  (via drill 0.6)
  Top 0.254: R45.2 arc-90 197.18,82.55 v199.39,82.55
N$97
  Top 0.813: R49.1 37.36,8.86 LED13.A
N$98
  Top 0.813: R50.2 SLOT13_1.2
N$99
  Top 0.813: R51.2 SLOT13_2.2
N$100
  Top 0.813: R52.2 SLOT13_4.2
N$101
  Top 0.813: LED14.A 82.89,8.92 R53.1
N$102
  Top 0.813: R54.2 SLOT14_1.2
N$103
  Top 0.813: R55.2 SLOT14_2.2
N$104
  Top 0.813: R56.2 SLOT14_3.2
N$105
  Top 0.813: LED15.A 135.03,8.92 R57.1
N$106
  Top 0.813: R58.2 SLOT15_1.2
N$107
  Top 0.813: R59.2 SLOT15_2.2
N$108
  Top 0.813: R60.2 SLOT15_3.2
N$109
  Top 0.813: LED16.A 188.09,8.86 R61.1
N$110
  Top 0.813: R62.2 SLOT16_1.2
N$111
  Top 0.813: R63.2 SLOT16_2.2
N$112
  Top 0.813: R64.2 SLOT16_3.2
N$113  (via drill 0.6)
  Top 0.254: SLOT16_3.1 arc-90 194.31,57.81 194.31,59.69 195.58,60.96 v198.12,60.96
N$114  (via drill 0.6)
  Top 0.254: SLOT16_2.1 arc-90 181.61,58.01 181.61,59.69 184.15,62.23 v198.12,62.23
N$115  (via drill 0.6)
  Top 0.254: SLOT16_1.1 arc-90 168.91,58.21 168.91,60.96 171.45,63.5 v198.12,63.5
N$116  (via drill 0.6)
  Top 0.254: SLOT15_3.1 arc90 146.05,58.17 146.05,62.23 148.59,64.77 v198.12,64.77
N$117  (via drill 0.6)
  Top 0.254: SLOT15_2.1 arc90 133.35,57.97 133.35,63.5 135.89,66.04 v198.12,66.04
N$118  (via drill 0.6)
  Top 0.254: SLOT15_1.1 arc90 120.65,57.77 120.65,64.77 123.19,67.31 v198.12,67.31
N$119  (via drill 0.6)
  Top 0.254: SLOT14_3.1 arc90 93.98,58.1 93.98,66.04 96.52,68.58 v198.12,68.58
N$120  (via drill 0.6)
  Top 0.254: SLOT14_2.1 arc90 81.28,57.9 81.28,67.31 83.82,69.85 v198.12,69.85
N$121  (via drill 0.6)
  Top 0.254: SLOT14_1.1 arc90 68.58,57.7 68.58,68.58 71.12,71.12 v198.12,71.12
N$122  (via drill 0.6)
  Top 0.254: SLOT13_4.1 arc90 43.18,58.3 43.18,69.85 45.72,72.39 v198.12,72.39
N$123  (via drill 0.6)
  Top 0.254: SLOT13_2.1 arc90 30.48,58.1 30.48,71.12 33.02,73.66 v198.12,73.66
N$124  (via drill 0.6)
  Top 0.254: SLOT13_1.1 arc90 17.78,57.9 17.78,72.39 20.32,74.93 v198.12,74.93
N$125  (via drill 0.6)
  Top 0.254: R49.2 arc-90 48.26,8.24 48.26,4.45 48.9,3.81 v201.93,3.81
N$126  (via drill 0.6)
  Top 0.254: R53.2 arc-90 99.06,8.44 99.06,5.71 99.69,5.08 v201.93,5.08
N$127  (via drill 0.6)
  Top 0.254: R57.2 arc-90 151.13,8.37 151.13,6.99 151.76,6.35 v201.93,6.35
N$128  (via drill 0.6)
  Top 0.254: R61.2 arc90 199.61,8.89 v201.93,8.89
N$129  (via drill 0.6)
  Top 0.254: SLOT3_2.1 arc90 133.35,278.13 133.35,283.21 135.89,285.75 v199.39,285.75
VCC  (via drill 0.6)
  Top 0.813: R2.1 R3.1 R4.1 R6.1 R7.1 R8.1 R10.1 R11.1 R12.1 R14.1 R15.1 R16.1 | R50.1 17.44,17.78 | 193.12,91.44 R48.1 R47.1 R46.1 R44.1 R43.1 R42.1 R40.1 R39.1 R38.1 R36.1 R35.1 R34.1 | 3.81,237.49 3.81,287.02 3.81,289.68 3.81,292.18 8.81,297.18 v194.31,297.18 | 3.81,237.49 3.81,163.83 | 3.81,163.83 3.81,91.44 | R2.1 arc-90 16.99,237.49 | R18.1 arc-90 16.03,163.83 | R2.1 arc-90 16.99,237.49 | R50.1 arc-90 17.44,17.78 | R2.1 arc-90 16.99,237.49 | 16.99,237.49 3.81,237.49 | R18.1 arc-90 16.03,163.83 | R34.1 arc90 16.12,91.44 | R50.1 R51.1 R52.1 R54.1 R55.1 R56.1 R58.1 R59.1 R60.1 R62.1 R64.1 R63.1 | R18.1 arc-90 16.03,163.83 | 16.03,163.83 3.81,163.83 | R19.1 arc-90 28.53,163.83 | 28.53,163.83 16.03,163.83 | 28.53,163.83 41.03,163.83 arc90 R20.1 R22.1 R23.1 R24.1 R26.1 R27.1 R28.1 R30.1 R31.1 R32.1 | R34.1 arc90 16.12,91.44 | 16.12,91.44 3.81,91.44 | 3.81,91.44 3.81,20.32 6.35,17.78 17.44,17.78